# EasyEDA Pro project ProPrj_ch32v305_pico.epro, schematic Schematic1
Assembly Variant: Basic; Board Name: Board1; Create Date: 2026-08-02; Page Name: P1; Project Name: CH32V305 Pico; Schematic Name: Schematic1; Update Date: 2026-08-02; Company: 嘉立创EDA; Page Size: A4; Version: V1.0
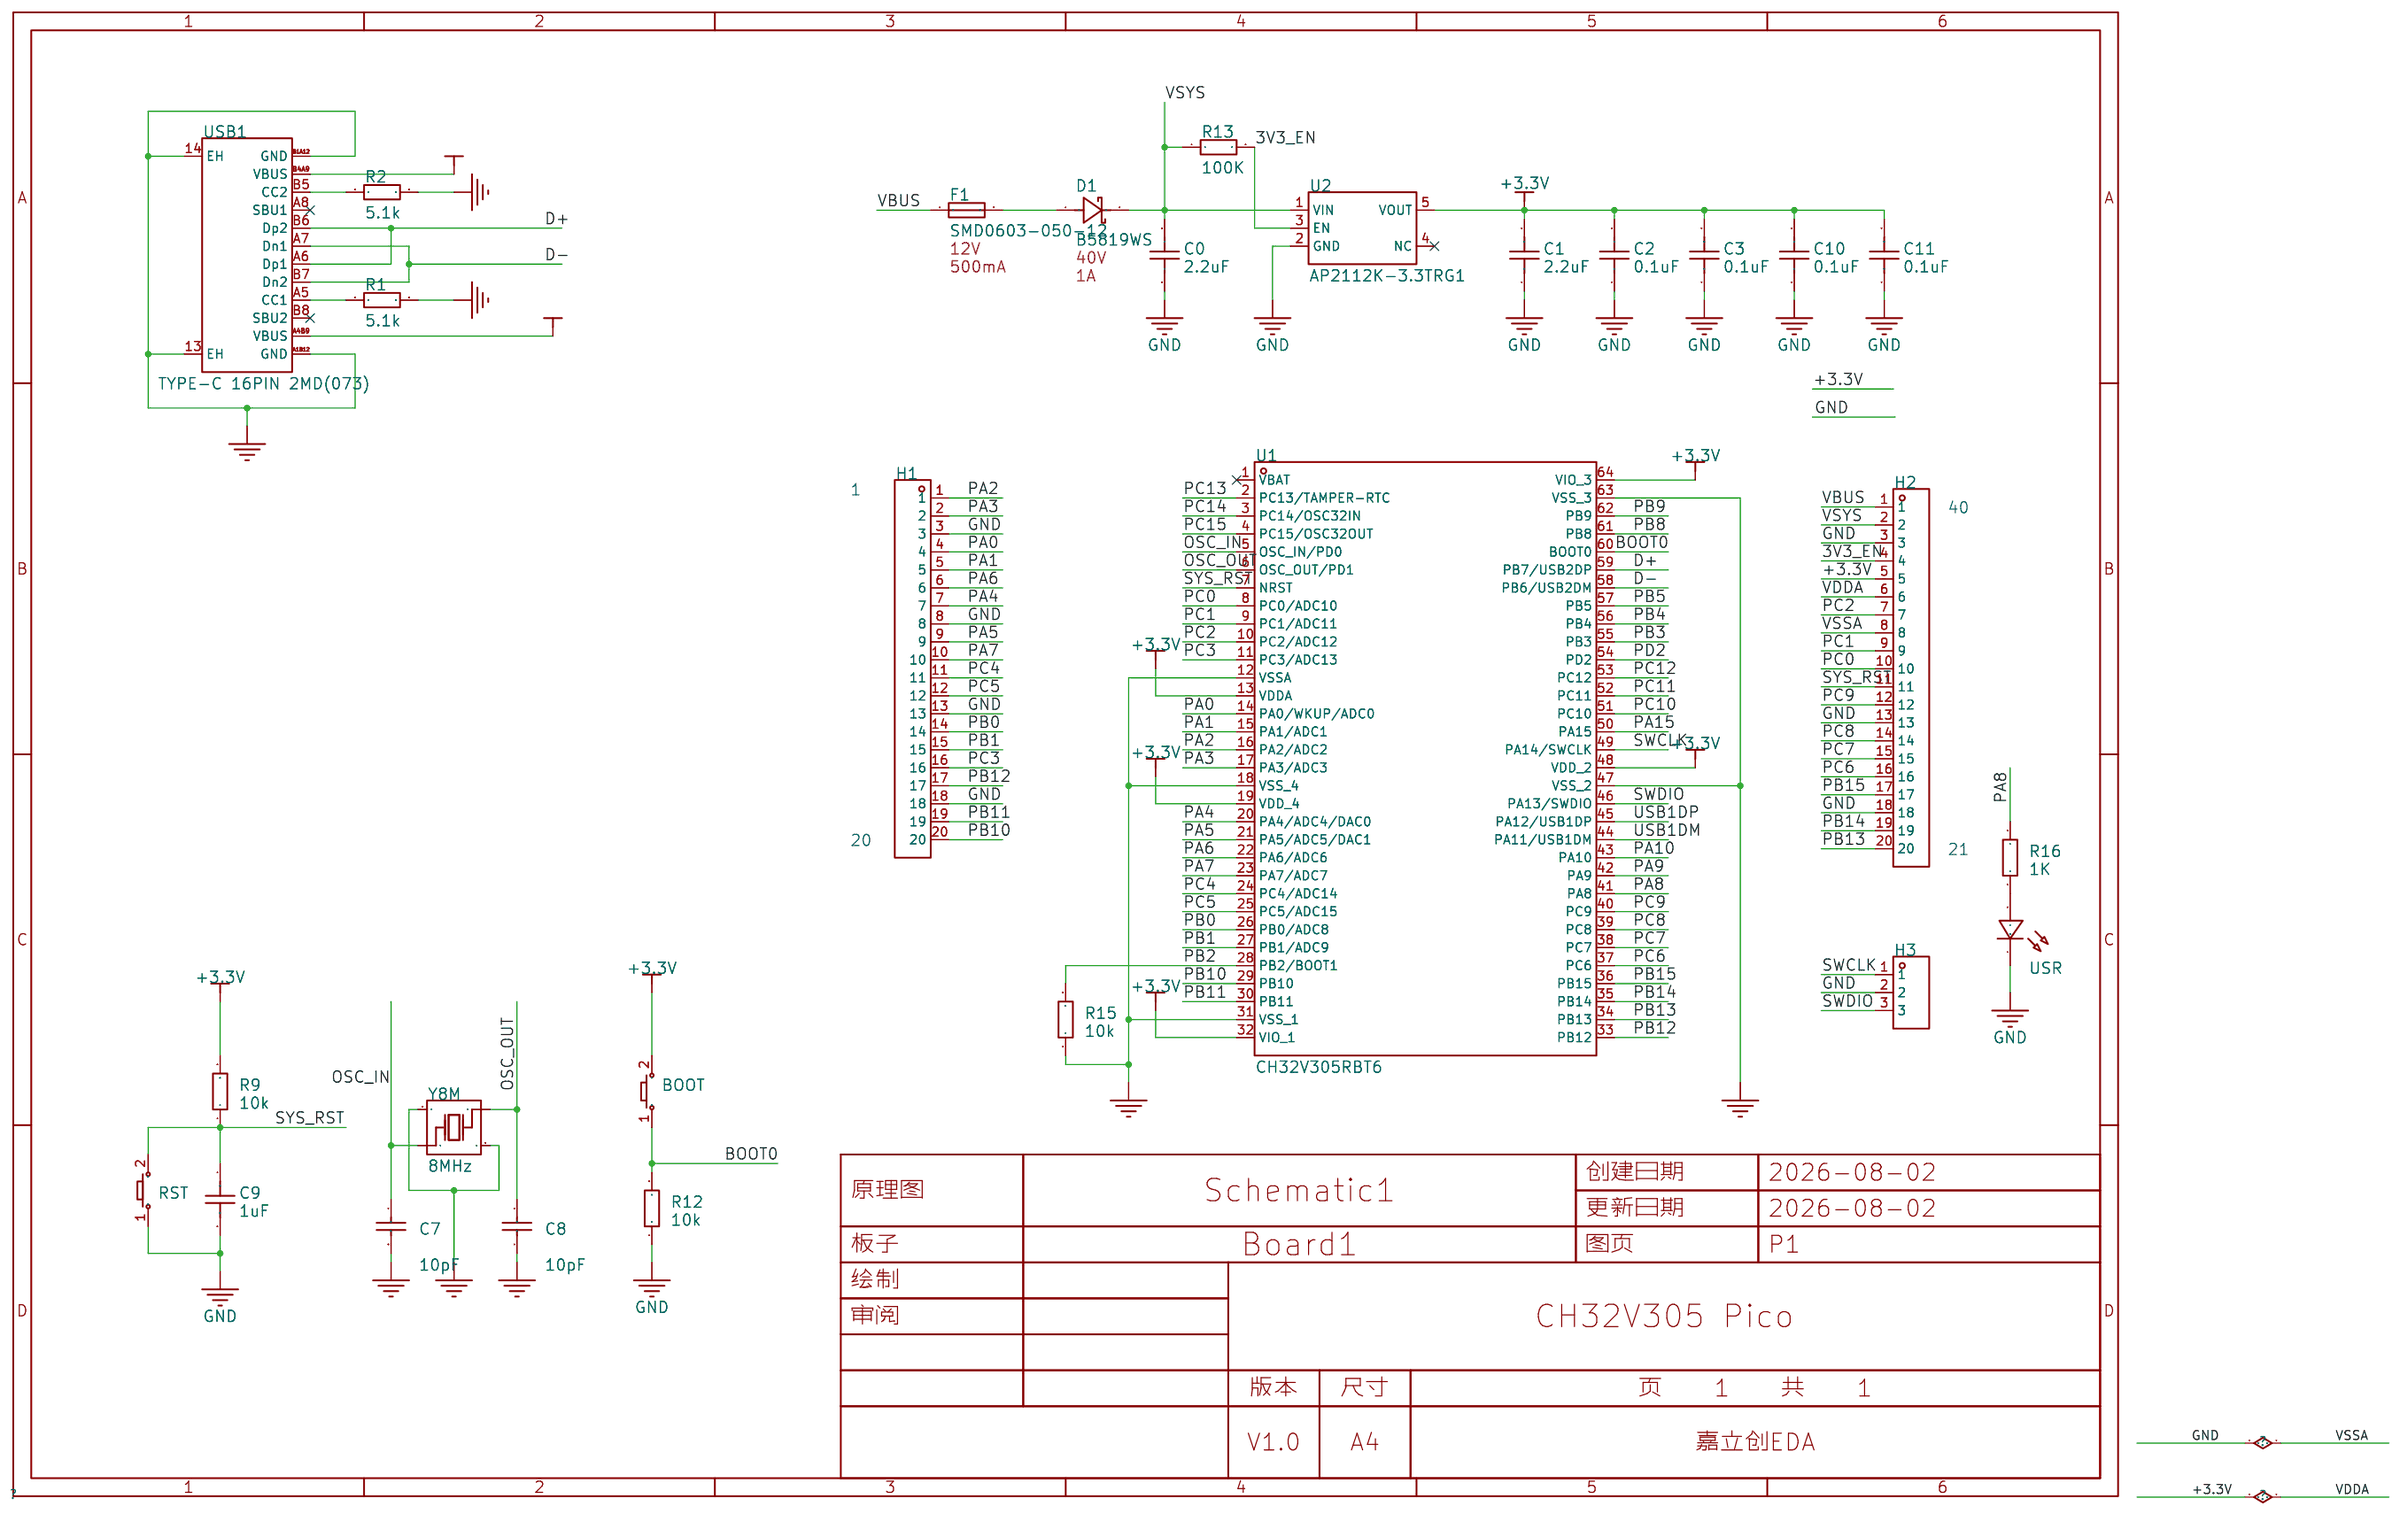
[diagram p4: schematic sheet]

## Parts
BOOT  -  [Key_SMD_3x4x2]
C0  2.2uF  [C0603]
C1  2.2uF  [C0603]
C2  0.1uF  [C0603]
C3  0.1uF  [C0603]
C7  10pF  [C0603]
C8  10pF  [C0603]
C9  1uF  [C0603]
C10  0.1uF  [C0603]
C11  0.1uF  [C0603]
D1  B5819WS  [SOD-323_L1.7-W1.3-LS2.5-FD]
F1  SMD0603-050-12  [F0603]
H1  -  [HDR-TH_20P-P2.54-V-M-1]
H2  -  [HDR-TH_20P-P2.54-V-M-1]
H3  -  [HDR-TH_3P-P2.54-V-M]
R1  5.1k  [R0603]
R2  5.1k  [R0603]
R9  10k  [R0603]
R12  10k  [R0603]
R13  100K  [R0603]
R15  10k  [R0603]
R16  1K  [R0603]
RST  -  [Key_SMD_3x4x2]
U1  CH32V305RBT6  [LQFP-64_L10.0-W10.0-P0.50-LS12.0-BL]
U2  AP2112K-3.3TRG1  [SOT-23-5_L2.9-W1.6-P0.95-LS2.8-BR]
USB1  TYPE-C 16PIN 2MD(073)  [USB-C-SMD_TYPE-C-16PIN-2MD-073]
USR  -  [LED_0603]
Y8M  8MHz  [CRYSTAL-SMD_4P-L3.2-W2.5-BL]

## Library data of the parts
BOOT RST = Key_SMD_3x4x2: Supplier Footprint: SMD
C0-C3 C9-C11 = CAP_0603: 容值:100nF;精度:±10%;额定电压:50V;温度系数:X7R;; Supplier Footprint: 0603
C7 C8 = CL10C100JB8NNNC: 容值:10pF;精度:±5%;额定电压:50V;温度系数:C0G;; LCSC Part Name: 10pF ±5% 50V; Supplier Part: C1634; Manufacturer: SAMSUNG(三星); Supplier Footprint: 0603; JLCPCB Part Class: Basic Part; Datasheet: https://item.szlcsc.com/datasheet/CL10C100JB8NNNC/1986.html; Supplier: LCSC; Tolerance: ±5%; Voltage Rating: 50V; Temperature Coefficient: C0G
D1 = B5819WS_C7420331: 二极管配置:独立式;正向压降(Vf):600mV@1.0A;直流反向耐压(Vr):40V;整流电流:1A;; LCSC Part Name: 电压:40V 电流:1A; Supplier Part: C7420331; Manufacturer: R+O(宏嘉诚); Supplier Footprint: SOD-323; JLCPCB Part Class: Extended Part; Datasheet: https://item.szlcsc.com/datasheet/B5819WS/8397153.html; Supplier: LCSC; Diode Configuration: 独立式; Voltage - Forward(Vf@If): 600mV@1.0A; Voltage - DC Reverse(Vr): 40V; Current - Rectified: 1A; Reverse Leakage Current (Ir): 1mA@40V; Operating Junction Temperature Range: -55℃~+150℃; Non-Repetitive Peak Forward Surge Current: 10A
F1 = SMD0603-050-12: 耐压(Vmax):12V;最大电流(Imax):40A;保持电流(Ihold):500mA;跳闸电流(Itrip):1A;; LCSC Part Name: 12V 500mA; Supplier Part: C46640963; Manufacturer: R+O(宏嘉诚); Supplier Footprint: 0603; JLCPCB Part Class: Extended Part; Datasheet: https://item.szlcsc.com/datasheet/SMD0603-050-12/48798669.html; Supplier: LCSC; Voltage - Max: 12V; Current - Max: 40A; Hold Current: 500mA; Trip Current: 1A; Power Dissipation: 500mW; Resistance - Initial (Ri) (Min): 100mΩ; Resistance - Post Trip (R1) (Max): 800mΩ; Time to Trip(Max): 100ms; Operating Temperature: -40℃~+85℃; Length: 1.6mm; Width: 0.8mm
H1 H2 = HDR-M_2.54_1x20P: 间距:2.54mm;总PIN位数:20;排数:1;插针结构:-;行距:-;安装类型:直插;圆针/方针:-;额定电流:-;额定电压:-;配合针长度:-;塑高:-;触头材质:黄铜;触头镀层:-;颜色:黑色;; Supplier Part: C50981; Supplier Footprint: 插件
H3 = HDR-M_2.54_1x3P: Supplier Part: C2937625; Supplier Footprint: 插件
R1 R2 R9 R12 R13 R15 R16 = Res_0603: Supplier Footprint: 0603
U1 = CH32V305RBT6: CPU内核:RISC-V4F;CPU最大主频:144MHz;CPU位数:32 Bit;; LCSC Part Name: 32位RISC-V内核MCU，144MHz主频，内置高速存储器，丰富外设功能; Supplier Part: C5187529; Manufacturer: WCH(南京沁恒); Supplier Footprint: LQFP-64M(10x10); JLCPCB Part Class: Extended Part; Datasheet: https://item.szlcsc.com/datasheet/CH32V305RBT6/5860927.html; Supplier: LCSC; CPU Core: RISC-V4F; CPU Maximum Speed: 144MHz; Core Size: 32 Bit; Program Storage Size: 128KB; Program Memory Type: FLASH; RAM Size: 32KB; Number of I/O: 51; ADC (Bit): 12bit; DAC (Bit): 12bit; Oscillator Type: 内置+外置; Voltage - Supply: 3.3V; Operating Temperature: -40℃~+85℃; Features: 窗口看门狗(WWDG)；独立看门狗(IWDG)；欠压检测(BOR/LVD/LVR/LVI)；日历功能；上电复位(POR)；看门狗复位；外部管脚复位(NRST)；软件复位；掉电复位(PDR)
U2 = AP2112K-3.3TRG1_C23380830: 输出极性:正极;工作电压:5.5V;输出电压:3.3V;输出电流:600mA;电源纹波抑制比(PSRR):75dB@(1kHz);输出类型:固定;; LCSC Part Name: 3.3V 600mA 5.5V; Supplier Part: C23380830; Manufacturer: TECH PUBLIC(台舟); Supplier Footprint: SOT-23-5; JLCPCB Part Class: Extended Part; Datasheet: https://item.szlcsc.com/datasheet/AP2112K-3.3TRG1/25111500.html; Supplier: LCSC; Output Configuration: 正极; Voltage - Supply: 5.5V; Output Voltage: 3.3V; Output Current: 600mA; Power Supply Rejection Ratio (PSRR): 75dB@(1kHz); Voltage Dropout: 320mV@(600mA); standby current: 10uA; Features: 使能控制；过流保护；输出放电；热关断; Operating Temperature: -40℃~+85℃@(Ta); Output Type: 固定; Number of Outputs: 1
USB1 = TYPE-C 16PIN 2MD(073): 连接器类型:Type-C;协议标准:-;公母:母;安装方式:卧贴;触点数量:16P;端口数量:1;额定电流 - 电源:3A;工作温度:-25℃~+85℃;; LCSC Part Name: Type-C 母 卧贴; Supplier Part: C2765186; Manufacturer: SHOU HAN(首韩); Supplier Footprint: SMD; JLCPCB Part Class: Extended Part; Datasheet: https://item.szlcsc.com/datasheet/TYPE-C%252016PIN%25202MD(073)/2901843.html; Supplier: LCSC; Connector Type: Type-C; Gender: 母; Mounting Type: 卧贴; Number of Contacts: 16P; Number of Ports: 1; Current Rating-Power: 3A; Voltage Rating: 5V; Connect-Disconnect Life: 1万次; Detection color: 黑色; Operating Temperature: -25℃~+85℃
USR = LED_0603-R: Supplier Footprint: 0603
Y8M = TAXM8M4RDBCCT2T: 晶振类型:贴片晶振;频率:8MHz;常温频差:±10ppm;负载电容:10pF;频率稳定度:±15ppm;; LCSC Part Name: 8MHz ±10ppm 10pF; Supplier Part: C400090; Manufacturer: YJX(雅晶鑫); Supplier Footprint: SMD3225-4P; JLCPCB Part Class: Extended Part; Datasheet: https://item.szlcsc.com/datasheet/TAXM8M4RDBCCT2T/383475.html; Supplier: LCSC; Type: 贴片晶振; Normal temperature Frequency Tolerance: ±10ppm; Load Capacitance: 10pF; Frequency Stability: ±15ppm; Equivalent Series Resistance(ESR): 250Ω; Operating Temperature: -40℃~+85℃

## Nets
3V3_EN: H2.4 R13.2 U2.3(EN)
+3.3V: BOOT.2 C1.2 C2.2 C3.2 C10.2 C11.2 H2.5 H2.6 R9.2 U1.13(VDDA) U1.19(VDD_4) U1.32(VIO_1) U1.48(VDD_2) U1.64(VIO_3) U2.5(VOUT)
GND: C0.1 C1.1 C2.1 C3.1 C7.2 C8.1 C9.2 C10.1 C11.1 H1.3 H1.8 H1.13 H1.18 H2.3 H2.8 H2.13 H2.18 H3.2 R1.2 R2.2 R12.1 R15.1 RST.1 U1.12(VSSA) U1.18(VSS_4) U1.31(VSS_1) U1.47(VSS_2) U1.63(VSS_3) U2.2(GND) USB1.13(EH) USB1.14(EH) USB1.A1B12(GND) USB1.B1A12(GND) USR.1(C) Y8M.2 Y8M.4
VBUS: F1.1 H2.1 USB1.A4B9(VBUS) USB1.B4A9(VBUS)
BOOT0: BOOT.1 R12.2 U1.60(BOOT0)
D+: U1.59(PB7/USB2DP) USB1.A6(Dp1) USB1.B6(Dp2)
D-: U1.58(PB6/USB2DM) USB1.A7(Dn1) USB1.B7(Dn2)
OSC_IN: C7.1 U1.5(OSC_IN/PD0) Y8M.1
OSC_OUT: C8.2 U1.6(OSC_OUT/PD1) Y8M.3
PA0: H1.4 U1.14(PA0/WKUP/ADC0)
PA1: H1.5 U1.15(PA1/ADC1)
PA2: H1.1 U1.16(PA2/ADC2)
PA3: H1.2 U1.17(PA3/ADC3)
PA4: H1.7 U1.20(PA4/ADC4/DAC0)
PA5: H1.9 U1.21(PA5/ADC5/DAC1)
PA6: H1.6 U1.22(PA6/ADC6)
PA7: H1.10 U1.23(PA7/ADC7)
PA8: R16.2 U1.41(PA8)
PA9: U1.42(PA9)
PA10: U1.43(PA10)
PA15: U1.50(PA15)
PB0: H1.14 U1.26(PB0/ADC8)
PB1: H1.15 U1.27(PB1/ADC9)
PB2: R15.2 U1.28(PB2/BOOT1)
PB3: U1.55(PB3)
PB4: U1.56(PB4)
PB5: U1.57(PB5)
PB8: U1.61(PB8)
PB9: U1.62(PB9)
PB10: H1.20 U1.29(PB10)
PB11: H1.19 U1.30(PB11)
PB12: H1.17 U1.33(PB12)
PB13: H2.20 U1.34(PB13)
PB14: H2.19 U1.35(PB14)
PB15: H2.17 U1.36(PB15)
PC0: H2.10 U1.8(PC0/ADC10)
PC1: H2.9 U1.9(PC1/ADC11)
PC2: H2.7 U1.10(PC2/ADC12)
PC3: H1.16 U1.11(PC3/ADC13)
PC4: H1.11 U1.24(PC4/ADC14)
PC5: H1.12 U1.25(PC5/ADC15)
PC6: H2.16 U1.37(PC6)
PC7: H2.15 U1.38(PC7)
PC8: H2.14 U1.39(PC8)
PC9: H2.12 U1.40(PC9)
PC10: U1.51(PC10)
PC11: U1.52(PC11)
PC12: U1.53(PC12)
PC13: U1.2(PC13/TAMPER-RTC)
PC14: U1.3(PC14/OSC32IN)
PC15: U1.4(PC15/OSC32OUT)
PD2: U1.54(PD2)
SWCLK: H3.1 U1.49(PA14/SWCLK)
SWDIO: H3.3 U1.46(PA13/SWDIO)
SYS_RST: C9.1 H2.11 R9.1 RST.2 U1.7(NRST)
USB1DM: U1.44(PA11/USB1DM)
USB1DP: U1.45(PA12/USB1DP)
VSYS: C0.2 D1.2(K) H2.2 R13.1 U2.1(VIN)
$1N10: R1.1 USB1.A5(CC1)
$1N11: R2.1 USB1.B5(CC2)
$1N150: D1.1(A) F1.2
$1N168: R16.1 USR.2(A)

Not connected (* = marked no-connect by the designer): U1 1(VBAT)*; U2 4(NC)*; USB1 A8(SBU1)* B8(SBU2)*

## Notes on the sheet
- 1
- 40
- 20
- 21
